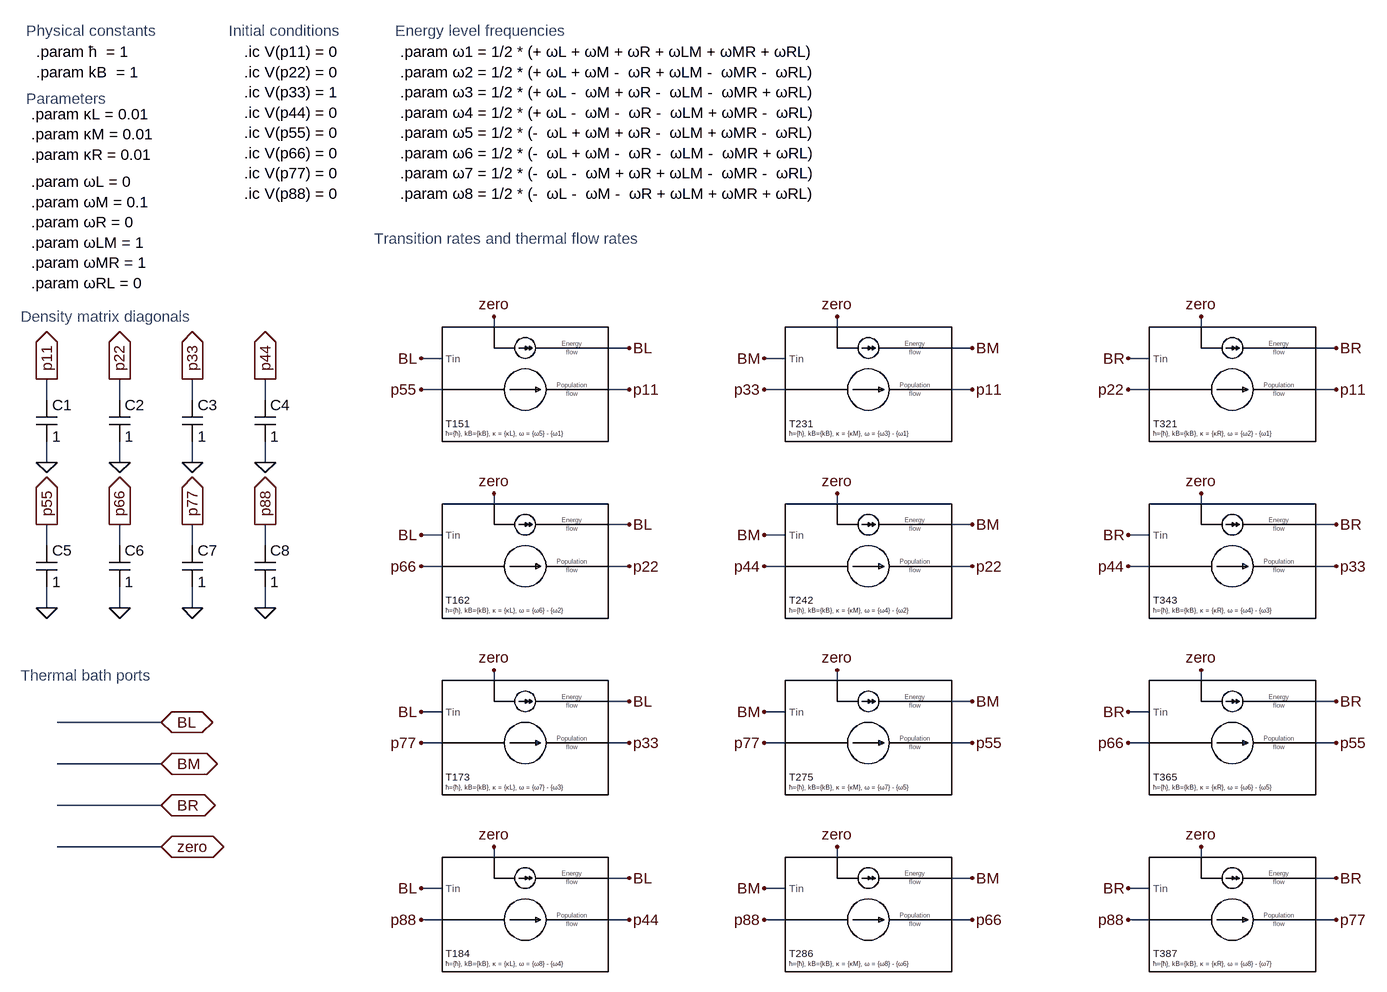
[diagram p0: schematic thermal_transistor_Joul.asc]
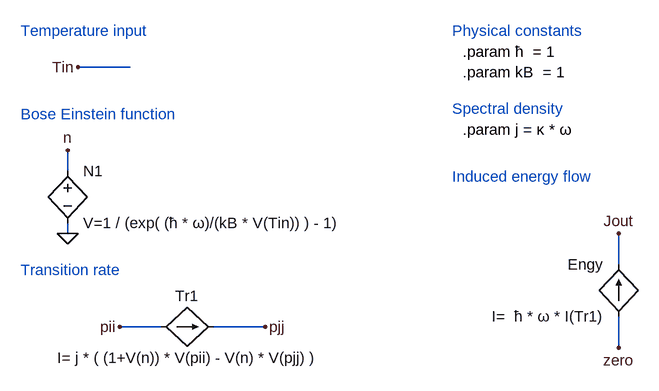
[diagram p1: sub-circuit transition_rate.asc]
thermal_transistor_Joul.asc, the LTspice schematic file:
Version 4
SHEET 1 2280 2404
WIRE 64 464 64 448
WIRE 592 464 592 448
WIRE 1152 464 1152 448
WIRE 272 496 240 496
WIRE 800 496 768 496
WIRE 1360 496 1328 496
WIRE -16 512 -48 512
WIRE 512 512 480 512
WIRE 1072 512 1040 512
WIRE -16 560 -48 560
WIRE 272 560 240 560
WIRE 512 560 480 560
WIRE 800 560 768 560
WIRE 1072 560 1040 560
WIRE 1360 560 1328 560
WIRE -624 576 -624 544
WIRE -512 576 -512 544
WIRE -400 576 -400 544
WIRE -288 576 -288 544
WIRE -624 672 -624 640
WIRE -512 672 -512 640
WIRE -400 672 -400 640
WIRE -288 672 -288 640
WIRE 64 736 64 720
WIRE 592 736 592 720
WIRE 1152 736 1152 720
WIRE 272 768 240 768
WIRE 800 768 768 768
WIRE 1360 768 1328 768
WIRE -16 784 -48 784
WIRE 512 784 480 784
WIRE 1072 784 1040 784
WIRE -624 800 -624 768
WIRE -512 800 -512 768
WIRE -400 800 -400 768
WIRE -288 800 -288 768
WIRE -16 832 -48 832
WIRE 272 832 240 832
WIRE 512 832 480 832
WIRE 800 832 768 832
WIRE 1072 832 1040 832
WIRE 1360 832 1328 832
WIRE -624 896 -624 864
WIRE -512 896 -512 864
WIRE -400 896 -400 864
WIRE -288 896 -288 864
WIRE 64 1008 64 992
WIRE 592 1008 592 992
WIRE 1152 1008 1152 992
WIRE 272 1040 240 1040
WIRE 800 1040 768 1040
WIRE 1360 1040 1328 1040
WIRE -16 1056 -48 1056
WIRE 512 1056 480 1056
WIRE 1072 1056 1040 1056
WIRE -448 1072 -608 1072
WIRE -16 1104 -48 1104
WIRE 272 1104 240 1104
WIRE 512 1104 480 1104
WIRE 800 1104 768 1104
WIRE 1072 1104 1040 1104
WIRE 1360 1104 1328 1104
WIRE -448 1136 -608 1136
WIRE -448 1200 -608 1200
WIRE -448 1264 -608 1264
WIRE 64 1280 64 1264
WIRE 592 1280 592 1264
WIRE 1152 1280 1152 1264
WIRE 272 1312 240 1312
WIRE 800 1312 768 1312
WIRE 1360 1312 1328 1312
WIRE -16 1328 -48 1328
WIRE 512 1328 480 1328
WIRE 1072 1328 1040 1328
WIRE -16 1376 -48 1376
WIRE 272 1376 240 1376
WIRE 512 1376 480 1376
WIRE 800 1376 768 1376
WIRE 1072 1376 1040 1376
WIRE 1360 1376 1328 1376
FLAG -624 672 0
FLAG -624 544 p11
IOPIN -624 544 Out
FLAG -512 672 0
FLAG -512 544 p22
IOPIN -512 544 Out
FLAG -400 672 0
FLAG -400 544 p33
IOPIN -400 544 Out
FLAG -288 672 0
FLAG -288 544 p44
IOPIN -288 544 Out
FLAG -624 896 0
FLAG -624 768 p55
IOPIN -624 768 Out
FLAG -512 896 0
FLAG -512 768 p66
IOPIN -512 768 Out
FLAG -400 896 0
FLAG -400 768 p77
IOPIN -400 768 Out
FLAG -288 896 0
FLAG -288 768 p88
IOPIN -288 768 Out
FLAG -48 560 p55
FLAG 272 560 p11
FLAG -48 512 BL
FLAG -48 832 p66
FLAG 272 832 p22
FLAG -48 784 BL
FLAG -48 1104 p77
FLAG 272 1104 p33
FLAG -48 1056 BL
FLAG -48 1376 p88
FLAG 272 1376 p44
FLAG -48 1328 BL
FLAG 480 560 p33
FLAG 800 560 p11
FLAG 480 512 BM
FLAG 480 832 p44
FLAG 800 832 p22
FLAG 480 784 BM
FLAG 480 1104 p77
FLAG 800 1104 p55
FLAG 480 1056 BM
FLAG 480 1376 p88
FLAG 800 1376 p66
FLAG 480 1328 BM
FLAG 1040 560 p22
FLAG 1360 560 p11
FLAG 1040 512 BR
FLAG 1040 832 p44
FLAG 1360 832 p33
FLAG 1040 784 BR
FLAG 1040 1104 p66
FLAG 1360 1104 p55
FLAG 1040 1056 BR
FLAG 1040 1376 p88
FLAG 1360 1376 p77
FLAG 1040 1328 BR
FLAG 272 496 BL
FLAG 272 768 BL
FLAG 272 1040 BL
FLAG 272 1312 BL
FLAG 800 1312 BM
FLAG 800 1040 BM
FLAG 800 768 BM
FLAG 800 496 BM
FLAG 1360 768 BR
FLAG 1360 496 BR
FLAG 1360 1040 BR
FLAG 1360 1312 BR
FLAG -448 1072 BL
IOPIN -448 1072 BiDir
FLAG -448 1136 BM
IOPIN -448 1136 BiDir
FLAG -448 1200 BR
IOPIN -448 1200 BiDir
FLAG -448 1264 zero
IOPIN -448 1264 BiDir
FLAG 592 448 zero
FLAG 64 448 zero
FLAG 64 720 zero
FLAG 592 720 zero
FLAG 1152 720 zero
FLAG 1152 448 zero
FLAG 592 992 zero
FLAG 64 992 zero
FLAG 1152 992 zero
FLAG 592 1264 zero
FLAG 64 1264 zero
FLAG 1152 1264 zero
SYMBOL cap -640 576 R0
SYMATTR InstName C1
SYMATTR Value 1
SYMBOL cap -528 576 R0
SYMATTR InstName C2
SYMATTR Value 1
SYMBOL cap -416 576 R0
SYMATTR InstName C3
SYMATTR Value 1
SYMBOL cap -304 576 R0
SYMATTR InstName C4
SYMATTR Value 1
SYMBOL cap -640 800 R0
SYMATTR InstName C5
SYMATTR Value 1
SYMBOL cap -528 800 R0
SYMATTR InstName C6
SYMATTR Value 1
SYMBOL cap -416 800 R0
SYMATTR InstName C7
SYMATTR Value 1
SYMBOL cap -304 800 R0
SYMATTR InstName C8
SYMATTR Value 1
SYMBOL transition_rate 32 496 R0
SYMATTR SpiceLine ħ={ħ}, kB={kB}, κ = {κL}, ω = {ω5} - {ω1}
SYMATTR InstName T151
SYMBOL transition_rate 32 768 R0
SYMATTR SpiceLine ħ={ħ}, kB={kB}, κ = {κL}, ω = {ω6} - {ω2}
SYMATTR InstName T162
SYMBOL transition_rate 32 1040 R0
SYMATTR SpiceLine ħ={ħ}, kB={kB}, κ = {κL}, ω = {ω7} - {ω3}
SYMATTR InstName T173
SYMBOL transition_rate 32 1312 R0
SYMATTR SpiceLine ħ={ħ}, kB={kB}, κ = {κL}, ω = {ω8} - {ω4}
SYMATTR InstName T184
SYMBOL transition_rate 560 496 R0
SYMATTR SpiceLine ħ={ħ}, kB={kB}, κ = {κM}, ω = {ω3} - {ω1}
SYMATTR InstName T231
SYMBOL transition_rate 560 768 R0
SYMATTR SpiceLine ħ={ħ}, kB={kB}, κ = {κM}, ω = {ω4} - {ω2}
SYMATTR InstName T242
SYMBOL transition_rate 560 1040 R0
SYMATTR SpiceLine ħ={ħ}, kB={kB}, κ = {κM}, ω = {ω7} - {ω5}
SYMATTR InstName T275
SYMBOL transition_rate 560 1312 R0
SYMATTR SpiceLine ħ={ħ}, kB={kB}, κ = {κM}, ω = {ω8} - {ω6}
SYMATTR InstName T286
SYMBOL transition_rate 1120 496 R0
SYMATTR SpiceLine ħ={ħ}, kB={kB}, κ = {κR}, ω = {ω2} - {ω1}
SYMATTR InstName T321
SYMBOL transition_rate 1120 768 R0
SYMATTR SpiceLine ħ={ħ}, kB={kB}, κ = {κR}, ω = {ω4} - {ω3}
SYMATTR InstName T343
SYMBOL transition_rate 1120 1040 R0
SYMATTR SpiceLine ħ={ħ}, kB={kB}, κ = {κR}, ω = {ω6} - {ω5}
SYMATTR InstName T365
SYMBOL transition_rate 1120 1312 R0
SYMATTR SpiceLine ħ={ħ}, kB={kB}, κ = {κR}, ω = {ω8} - {ω7}
SYMATTR InstName T387
TEXT -320 40 Left 2 !.ic V(p11) = 0\n.ic V(p22) = 0\n.ic V(p33) = 1\n.ic V(p44) = 0\n.ic V(p55) = 0\n.ic V(p66) = 0\n.ic V(p77) = 0\n.ic V(p88) = 0
TEXT -344 8 Left 2 ;Initial conditions
TEXT -664 448 Left 2 ;Density matrix diagonals
TEXT -120 328 Left 2 ;Transition rates and thermal flow rates
TEXT -656 112 Left 2 ;Parameters
TEXT -648 136 Left 2 !.param κL = 0.01\n.param κM = 0.01\n.param κR = 0.01
TEXT -648 240 Left 2 !.param ωL = 0\n.param ωM = 0.1\n.param ωR = 0\n.param ωLM = 1\n.param ωMR = 1\n.param ωRL = 0
TEXT -640 40 Left 2 !.param ħ  = 1\n.param kB  = 1
TEXT -656 8 Left 2 ;Physical constants
TEXT -88 8 Left 2 ;Energy level frequencies
TEXT -80 40 Left 2 !.param ω1 = 1/2 * (+ ωL + ωM + ωR + ωLM + ωMR + ωRL)\n.param ω2 = 1/2 * (+ ωL + ωM -  ωR + ωLM -  ωMR -  ωRL)\n.param ω3 = 1/2 * (+ ωL -  ωM + ωR -  ωLM -  ωMR + ωRL)\n.param ω4 = 1/2 * (+ ωL -  ωM -  ωR -  ωLM + ωMR -  ωRL)\n.param ω5 = 1/2 * (-  ωL + ωM + ωR -  ωLM + ωMR -  ωRL)\n.param ω6 = 1/2 * (-  ωL + ωM -  ωR -  ωLM -  ωMR + ωRL)\n.param ω7 = 1/2 * (-  ωL -  ωM + ωR + ωLM -  ωMR -  ωRL)\n.param ω8 = 1/2 * (-  ωL -  ωM -  ωR + ωLM + ωMR + ωRL)
TEXT -664 1000 Left 2 ;Thermal bath ports

transition_rate.asc, the sub-circuit schematic file:
Version 4
SHEET 1 880 680
WIRE -64 -96 -144 -96
WIRE -160 64 -160 32
WIRE -160 160 -160 144
WIRE 688 208 688 160
WIRE -16 304 -80 304
WIRE 144 304 64 304
WIRE 688 336 688 288
FLAG -160 160 0
FLAG -144 -96 Tin
FLAG -160 32 n
FLAG -80 304 pii
FLAG 144 304 pjj
FLAG 688 160 Jout
FLAG 688 336 zero
SYMBOL bv -160 48 R0
SYMATTR InstName N1
SYMATTR Value V=1 / (exp( (ħ * ω)/(kB * V(Tin)) ) - 1)
SYMBOL bi -16 304 R270
WINDOW 0 32 40 VTop 2
WINDOW 3 -32 40 VBottom 2
SYMATTR InstName Tr1
SYMATTR Value I= j * ( (1+V(n)) * V(pii) - V(n) * V(pjj) )
SYMBOL bi 688 288 R180
WINDOW 0 24 80 Left 2
WINDOW 3 24 0 Left 2
SYMATTR InstName Engy
SYMATTR Value I=  ħ * ω * I(Tr1)
TEXT -232 -24 Left 2 ;Bose Einstein function
TEXT -232 -152 Left 2 ;Temperature input
TEXT -232 216 Left 2 ;Transition rate
TEXT 432 -152 Left 2 ;Physical constants
TEXT 448 -120 Left 2 !.param ħ  = 1\n.param kB  = 1
TEXT 432 -32 Left 2 ;Spectral density
TEXT 448 0 Left 2 !.param j = κ * ω
TEXT 432 72 Left 2 ;Induced energy flow

The netlist it stands for:
* thermal_transistor_Joul.asc
C1 p11 0 1
C2 p22 0 1
C3 p33 0 1
C4 p44 0 1
C5 p55 0 1
C6 p66 0 1
C7 p77 0 1
C8 p88 0 1
XT151 BL p55 p11 BL zero transition_rate params: ħ={ħ}, kB={kB}, κ = {κL}, ω = {ω5} - {ω1}
XT162 BL p66 p22 BL zero transition_rate params: ħ={ħ}, kB={kB}, κ = {κL}, ω = {ω6} - {ω2}
XT173 BL p77 p33 BL zero transition_rate params: ħ={ħ}, kB={kB}, κ = {κL}, ω = {ω7} - {ω3}
XT184 BL p88 p44 BL zero transition_rate params: ħ={ħ}, kB={kB}, κ = {κL}, ω = {ω8} - {ω4}
XT231 BM p33 p11 BM zero transition_rate params: ħ={ħ}, kB={kB}, κ = {κM}, ω = {ω3} - {ω1}
XT242 BM p44 p22 BM zero transition_rate params: ħ={ħ}, kB={kB}, κ = {κM}, ω = {ω4} - {ω2}
XT275 BM p77 p55 BM zero transition_rate params: ħ={ħ}, kB={kB}, κ = {κM}, ω = {ω7} - {ω5}
XT286 BM p88 p66 BM zero transition_rate params: ħ={ħ}, kB={kB}, κ = {κM}, ω = {ω8} - {ω6}
XT321 BR p22 p11 BR zero transition_rate params: ħ={ħ}, kB={kB}, κ = {κR}, ω = {ω2} - {ω1}
XT343 BR p44 p33 BR zero transition_rate params: ħ={ħ}, kB={kB}, κ = {κR}, ω = {ω4} - {ω3}
XT365 BR p66 p55 BR zero transition_rate params: ħ={ħ}, kB={kB}, κ = {κR}, ω = {ω6} - {ω5}
XT387 BR p88 p77 BR zero transition_rate params: ħ={ħ}, kB={kB}, κ = {κR}, ω = {ω8} - {ω7}

* block symbol definitions
.subckt transition_rate Tin pii pjj Jout zero
B§N1 n 0 V=1 / (exp( (ħ * ω)/(kB * V(Tin)) ) - 1)
B§Tr1 pii pjj I= j * ( (1+V(n)) * V(pii) - V(n) * V(pjj) )
B§Engy zero Jout I=  ħ * ω * I(Tr1)
* Bose Einstein function
* Temperature input
* Transition rate
* Physical constants
.param ħ  = 1
.param kB  = 1
* Spectral density
.param j = κ * ω
* Induced energy flow
.ends transition_rate

.ic V(p11) = 0
.ic V(p22) = 0
.ic V(p33) = 1
.ic V(p44) = 0
.ic V(p55) = 0
.ic V(p66) = 0
.ic V(p77) = 0
.ic V(p88) = 0
* Initial conditions
* Density matrix diagonals
* Transition rates and thermal flow rates
* Parameters
.param κL = 0.01
.param κM = 0.01
.param κR = 0.01
.param ωL = 0
.param ωM = 0.1
.param ωR = 0
.param ωLM = 1
.param ωMR = 1
.param ωRL = 0
.param ħ  = 1
.param kB  = 1
* Physical constants
* Energy level frequencies
.param ω1 = 1/2 * (+ ωL + ωM + ωR + ωLM + ωMR + ωRL)
.param ω2 = 1/2 * (+ ωL + ωM -  ωR + ωLM -  ωMR -  ωRL)
.param ω3 = 1/2 * (+ ωL -  ωM + ωR -  ωLM -  ωMR + ωRL)
.param ω4 = 1/2 * (+ ωL -  ωM -  ωR -  ωLM + ωMR -  ωRL)
.param ω5 = 1/2 * (-  ωL + ωM + ωR -  ωLM + ωMR -  ωRL)
.param ω6 = 1/2 * (-  ωL + ωM -  ωR -  ωLM -  ωMR + ωRL)
.param ω7 = 1/2 * (-  ωL -  ωM + ωR + ωLM -  ωMR -  ωRL)
.param ω8 = 1/2 * (-  ωL -  ωM -  ωR + ωLM + ωMR + ωRL)
* Thermal bath ports
.backanno
.end